# Altium schematic sheet buz_schematic.SchDoc
size A4; SheetNumber: 1; SheetTotal: 1
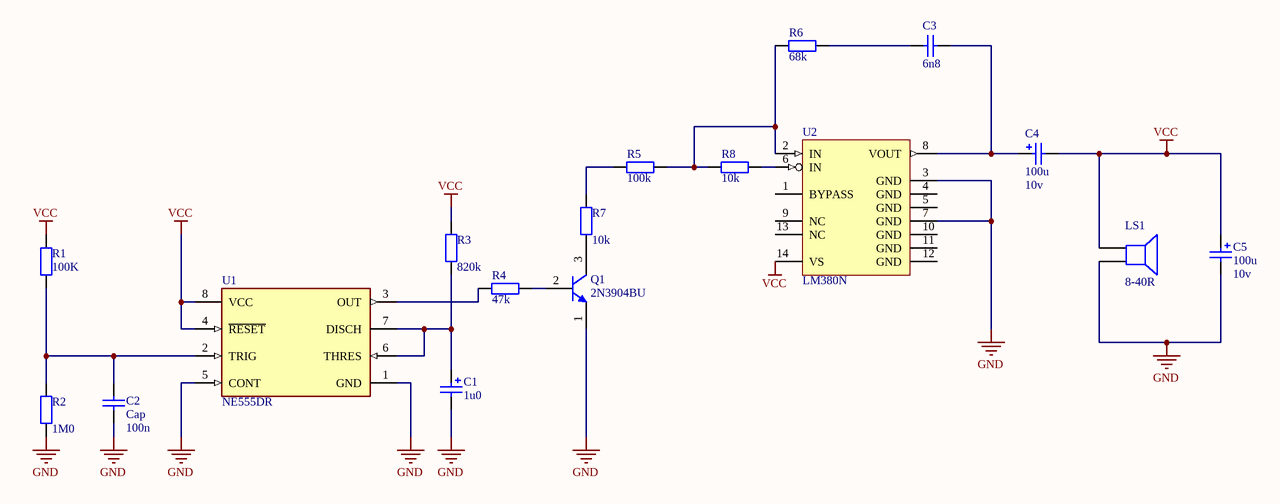
[diagram p0: buz_schematic.SchDoc]

## Parts
C1  1u0  [RB7.6-15]
C2  Cap  value 100n  [RAD-0.3]
C3  6n8  [RAD-0.3]
C4  100u  value 10v  [RB7.6-15]
C5  100u  value 10v  [RB7.6-15]
LS1  8-40R  [AXIAL-0.4]
Q1  2N3904BU  [FAIR-TO-92]
R1  value 100K  [AXIAL-0.4]  (hidden comment: Res2)
R2  value 1M0  [AXIAL-0.4]  (hidden comment: Res2)
R3  value 820k  [AXIAL-0.4]  (hidden comment: Res2)
R4  value 47k  [AXIAL-0.4]  (hidden comment: Res2)
R5  value 100k  [AXIAL-0.4]  (hidden comment: Res2)
R6  value 68k  [AXIAL-0.4]  (hidden comment: Res2)
R7  value 10k  [AXIAL-0.4]  (hidden comment: Res2)
R8  value 10k  [AXIAL-0.4]  (hidden comment: Res2)
U1  NE555DR  [FP-D0008A-IPC_C]
U2  LM380N  [N14A]

## Nets
GND: C1.2 C2.1 C5.2 LS1.2 Q1.1(E) R2.1 U1.1(GND) U1.5(CONT) U2.3(GND) U2.7(GND)
VCC: C4.2 C5.1 LS1.1 R1.1 R3.2 U1.4(~{RESET}) U1.8(VCC) U2.14(VS)
NetC1_1: C1.1 R3.1 U1.6(THRES) U1.7(DISCH)
NetC2_2: C2.2 R1.2 R2.2 U1.2(TRIG)
NetC3_1: C3.1 R6.1
NetC3_2: C3.2 C4.1 U2.8(VOUT)
NetQ1_2: Q1.2(B) R4.1
NetQ1_3: Q1.3(C) R7.1
NetR4_2: R4.2 U1.3(OUT)
NetR5_1: R5.1 R6.2 R8.2 U2.2(IN)
NetR5_2: R5.2 R7.2
NetR8_1: R8.1 U2.6(IN)

Not connected (* = marked no-connect by the designer): U2 1(BYPASS) 4(GND) 5(GND) 9(NC) 10(GND) 11(GND) 12(GND) 13(NC)

## Library data of the parts
C1 C4 C5 = Cap Pol1: Polarized Capacitor (Radial); Published: 8-Jun-2000; LatestRevisionDate: 17-Jul-2002; LatestRevisionNote: Re-released for DXP Platform.; PackageReference: RB7.6-15; Publisher: Altium Limited; PackageDescription: Polarized Capacitor (Radial); 2 Leads
C2 C3 = Cap: Capacitor; Published: 8-Jun-2000; LatestRevisionDate: 17-Jul-2002; LatestRevisionNote: Re-released for DXP Platform.; PackageReference: RAD-0.3; Publisher: Altium Limited; PackageDescription: Radial Cap, Thru-Hole; 2 Leads; 0.3 in Pin Spacing
  C3: Value: 6n8
LS1 = Speaker: Loudspeaker; Published: 24-Mar-1999; LatestRevisionDate: 17-Jul-2002; LatestRevisionNote: Re-released for DXP Platform.; PackageReference: PIN2; Publisher: Altium Limited
Q1 = 2N3904BU: NPN General-Purpose Amplifier, 40 V VCEO, 0.2 A, -55 to 150 degC, 2-Pin TO-92, RoHS, Bulk; Manufacturer: FairchildSemiconductor; Maximum Collector Base Voltage: 60V; Minimum DC Current Gain: 40@0.1mA@1V|70@1mA@1V|100@10mA@1V|60@50mA@1V|30@100mA@1V; Maximum Collector Emitter Voltage: 40V; Maximum DC Collector Current: 0.2A; Rad Hard: No; Maximum Operating Frequency: 300(Min)MHz; Maximum Collector Emitter Saturation Voltage: 0.2@1mA@10mA|0.3@5mA@50mAV; Maximum Power Dissipation: 625mW; Package Description: 3-Pin Transistor Outline Package, Body Dia 4.79 mm, Pitch 1.27 mm; Package Reference: TO-92; Pin Count: 3; Operating Temperature: -55to150degC; Category: GPBJT; Manufacturer URL: https://www.fairchildsemi.com/; Datasheet URL: https://datasheet.ciiva.com/4722/2n3904-82270-4722369.pdf; Package: 3TO-92; Packaging: Bulk; Type: NPN; Datasheet Version: Rev. 1.1.0, 10/2014; Mounting: ThroughHole
R1-R8 = Res2: Resistor; Published: 8-Jun-2000; LatestRevisionDate: 17-Jul-2002; LatestRevisionNote: Re-released for DXP Platform.; PackageReference: AXIAL-0.4; Publisher: Altium Limited; PackageDescription: Axial Device, Thru-Hole; 2 Leads; 0.4 in Pin Spacing
U1 = 555: IC OSC SGL TIMER 100KHZ 8-SOIC; Low Level Output Current: 200mA; Quiescent Current: 15mA; Min Supply Voltage: 4.5V; Number of Timers/Counters: 1; Max Supply Voltage: 16V; Operating Supply Current: 10mA; High Level Output Current: -200mA; Packaging: Tape and Reel; Frequency: 100kHz; Weight: 0.002561oz; REACH SVHC: No SVHC; Package Quantity: 2500; Width: 3.91mm; Max Operating Temperature: 70°C; Contact Plating: Gold; Lead Free: Lead Free; Number of Pins: 8; Min Operating Temperature: 0°C; Radiation Hardening: No; Length: 4.9mm; Case/Package: SOIC; Height: 1.58mm; Mount: Surface Mount
U2 = LM380N: 2.5W Audio Power Amplifier, 14-pin MDIP; Manufacturer: National Semiconductor; PowerWise: N; CompType: Audio IC; PackageTopMarking: NSUZXYYTTE#*LM380N; PinCount: 14; PackageDescription: MDIP, .750 x .250 x.130in, 14 Lead, .100in Pitch; DatasheetVersion: Aug-2000; Code_JEDEC: MS-001-AA; RevisionNote: Component URLs added; PackageReference: N14A; ComponentLink2URL: http://www.national.com/pf/LM/LM380.html; PackageVersion: revG, May-2006; RoHS: N; ComponentLink3URL: http://www.national.com/packaging/folders/n14a.html; ComponentLink1URL: http://www.national.com/ds/LM/LM380.pdf; ComponentLink3Description: N14A Package Page; ComponentLink2Description: LM380 Web Page; ComponentLink1Description: LM380 Datasheet